# Altium schematic sheet Sheet2.SchDoc
size A4; SheetNumber: 2; SheetTotal: 5
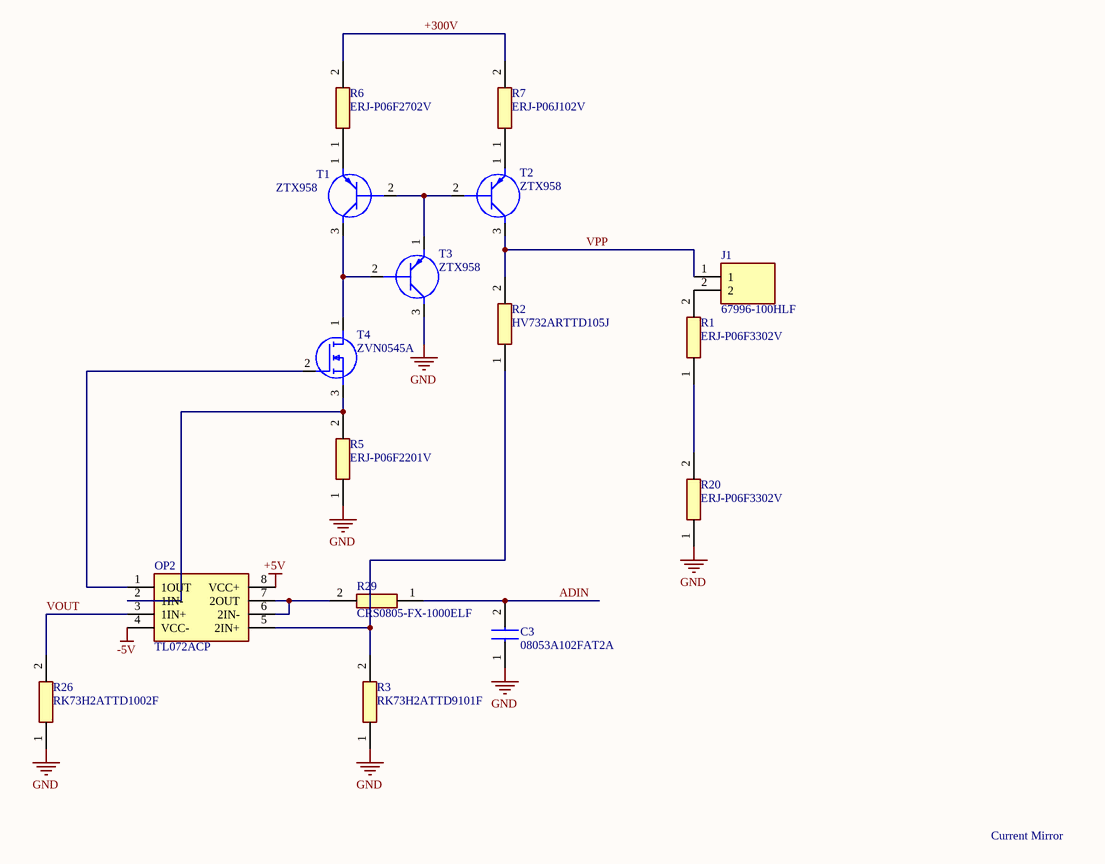
[diagram p0: Sheet2.SchDoc]

## Parts
C3  08053A102FAT2A  [CAPC2012X100N]
J1  67996-100HLF  [HDRV2W67P254_2X1_254X483X858P]
OP2  TL072ACP  [DIP794W53P254L959H508Q8N]
R1  ERJ-P06F3302V  [RESC2012X60N]
R2  HV732ARTTD105J  [RESC2012X60N]
R3  RK73H2ATTD9101F  [RESC2012X60N]
R5  ERJ-P06F2201V  [RESC2012X60N]
R6  ERJ-P06F2702V  [RESC2012X60N]
R7  ERJ-P06J102V  [RESC2012X60N]
R20  ERJ-P06F3302V  [RESC2012X60N]
R26  RK73H2ATTD1002F  [RESC2012X60N]
R29  CRS0805-FX-1000ELF  [RESC2012X60N]
T1  ZTX958  [KSP92BU]
T2  ZTX958  [KSP92BU]
T3  ZTX958  [KSP92BU]
T4  ZVN0545A  [BS107P]

## Nets
+5V: OP2.8(VCC+)
-5V: OP2.4(VCC-)
GND: C3.1 R3.1 R5.1 R20.1 R26.1 T3.3(C)
+300V: R6.2 R7.2
ADIN: C3.2 R29.1
VOUT: OP2.3(1IN+) R26.2
VPP: J1.1 R2.2 T2.3(C)
NetJ1_2: J1.2 R1.2
NetOP2_1: OP2.1(1OUT) T4.2(G)
NetOP2_2: OP2.2(1IN-) R5.2 T4.3(S)
NetOP2_5: OP2.5(2IN+) R2.1 R3.2
NetOP2_6: OP2.6(2IN-) OP2.7(2OUT) R29.2
NetR1_1: R1.1 R20.2
NetR6_1: R6.1 T1.1(E)
NetR7_1: R7.1 T2.1(E)
NetT1_2: T1.2(B) T2.2(B) T3.1(E)
NetT1_3: T1.3(C) T3.2(B) T4.1(D)

## Notes on the sheet
- Current Mirror

## Library data of the parts
C3 = KGM21NR71E104KT: Capacitor; Manufacturer_Name: KYOCERA; Datasheet Link: https://spicat.kyocera-avx.com/product/mlcc/chartview/KGM21NR71E104KT/DataSheet/X7R; Height: 1mm; Manufacturer_Part_Number: KGM21NR71E104KT; Mouser Part Number: 581-KGM21NR71E104KT; Mouser Price/Stock: https://www.mouser.co.uk/ProductDetail/KYOCERA-AVX/KGM21NR71E104KT?qs=OcgtsXO%252B3gt5l3KgnBGsBw%3D%3D
J1 = 67996-100HLF: BergStik<sup>&reg;</sup>, Board to Board connector, Unshrouded vertical header, Through Hole, Double Row, 0 Positions, 2.54 mm (0.100in) Pitch; Manufacturer_Name: Amphenol Communications Solutions; Geometry.Height: 8.58mm; Mouser Part Number: *; Mouser Price/Stock: *; Manufacturer_Part_Number: 67996-100HLF; Datasheet Link: https://cdn.amphenol-cs.com/media/wysiwyg/files/drawing/67996.pdf
OP2 = TL072ACP: Integrated Circuit; Manufacturer_Name: Texas Instruments; Datasheet Link: http://www.ti.com/lit/ds/symlink/tl071a.pdf; Height: 5.08mm; Manufacturer_Part_Number: TL072ACP; Mouser Part Number: 595-TL072ACP; Mouser Price/Stock: https://www.mouser.co.uk/ProductDetail/Texas-Instruments/TL072ACP?qs=0OT4q4QBUTLFvIZ%252B%2FvrwoQ%3D%3D; Arrow Part Number: TL072ACP; Arrow Price/Stock: https://www.arrow.com/en/products/tl072acp/texas-instruments?region=nac
R1-R3 R5-R7 R20 R26 R29 = RK73B2ATTD123J: Resistor; Manufacturer_Name: KOA Speer; Datasheet Link: https://www.mouser.jp/datasheet/2/219/RK73B-1825463.pdf; Height: 0.6mm; Manufacturer_Part_Number: RK73B2ATTD123J
T1-T3 = KSP92BU: Transistor BJT PNP; Manufacturer_Name: onsemi; Datasheet Link: https://www.onsemi.com/pdf/datasheet/ksp92-d.pdf; Height: 4.78mm; Manufacturer_Part_Number: KSP92BU; Mouser Part Number: 512-KSP92BU; Mouser Price/Stock: https://www.mouser.co.uk/ProductDetail/onsemi-Fairchild/KSP92BU?qs=ReZUMDdiXnTz1Ne%252BGFaZdA%3D%3D; Arrow Part Number: KSP92BU; Arrow Price/Stock: https://www.arrow.com/en/products/ksp92bu/on-semiconductor?region=nac
T4 = BS107P: MOSFET (N-Channel); Manufacturer_Name: Diodes Incorporated; Datasheet Link: https://www.diodes.com/assets/Datasheets/BS107P.pdf; Height: 4.01mm; Manufacturer_Part_Number: BS107P; Mouser Part Number: 522-BS107P; Mouser Price/Stock: https://www.mouser.co.uk/ProductDetail/Diodes-Incorporated/BS107P/?qs=xZ%2FP%252Ba9zWqZfqH3YLLUN6w%3D%3D; Arrow Part Number: BS107P; Arrow Price/Stock: https://www.arrow.com/en/products/bs107p/diodes-incorporated